# EAGLE schematic design (EAGLE 7.3.0)

## Sheet 1 of 5: MCU
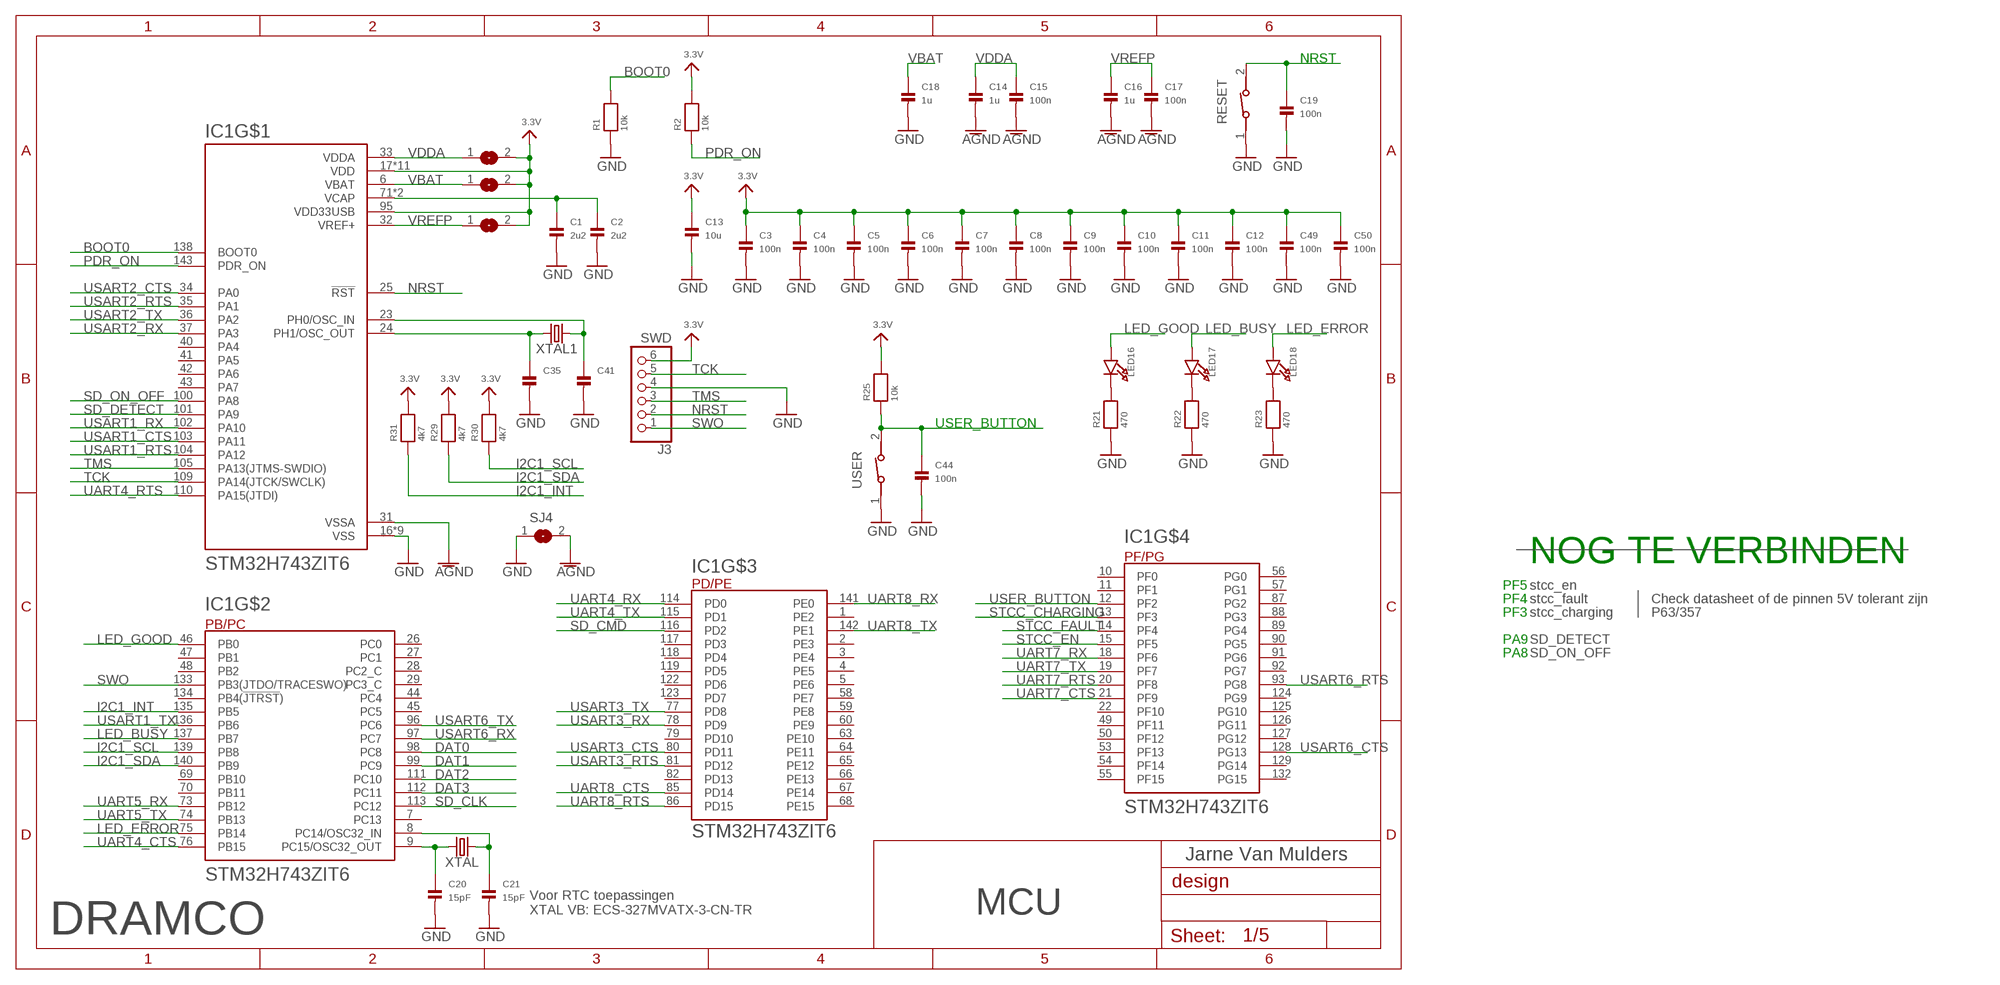
[diagram p0: schematic, sheet 1]

### Parts
C1  2u2  CAP_CERAMIC0805  [0805]
C2  2u2  CAP_CERAMIC0805  [0805]
C3  100n  CAP_CERAMIC0603  [0603]
C4  100n  CAP_CERAMIC0603  [0603]
C5  100n  CAP_CERAMIC0603  [0603]
C6  100n  CAP_CERAMIC0603  [0603]
C7  100n  CAP_CERAMIC0603  [0603]
C8  100n  CAP_CERAMIC0603  [0603]
C9  100n  CAP_CERAMIC0603  [0603]
C10  100n  CAP_CERAMIC0603  [0603]
C11  100n  CAP_CERAMIC0603  [0603]
C12  100n  CAP_CERAMIC0603  [0603]
C13  10u  CAP_CERAMIC0805  [0805]
C14  1u  CAP_CERAMIC0603  [0603]
C15  100n  CAP_CERAMIC0603  [0603]
C16  1u  CAP_CERAMIC0603  [0603]
C17  100n  CAP_CERAMIC0603  [0603]
C18  1u  CAP_CERAMIC0603  [0603]
C19  100n  CAP_CERAMIC0603  [0603]
C20  15pF  CAP_CERAMIC0603  [0603]
C21  15pF  CAP_CERAMIC0603  [0603]
C35  CAP_CERAMIC0603  [0603]
C41  CAP_CERAMIC0603  [0603]
C44  100n  CAP_CERAMIC0603  [0603]
C49  100n  CAP_CERAMIC0603  [0603]
C50  100n  CAP_CERAMIC0603  [0603]
IC1  STM32H743ZIT6  [QFP50P2200X2200X160-144N]
J3  SWD  HEADER-1X6ROUND  [1X06_ROUND]
LED16  LED0805  [CHIPLED_0805]
LED17  LED0805  [CHIPLED_0805]
LED18  LED0805  [CHIPLED_0805]
R1  10k  RESISTOR0603  [0603]
R2  10k  RESISTOR0603  [0603]
R21  470  RESISTOR0603  [0603]
R22  470  RESISTOR0603  [0603]
R23  470  RESISTOR0603  [0603]
R25  10k  RESISTOR0603  [0603]
R29  4k7  RESISTOR0603  [0603]
R30  4k7  RESISTOR0603  [0603]
R31  4k7  RESISTOR0603  [0603]
RESET  434111043826  [434111043826]
SJ1  SOLDERJUMPERCLOSED  [SOLDERJUMPER_CLOSEDWIRE]
SJ2  SOLDERJUMPERCLOSED  [SOLDERJUMPER_CLOSEDWIRE]
SJ3  SOLDERJUMPERCLOSED  [SOLDERJUMPER_CLOSEDWIRE]
SJ4  SOLDERJUMPERCLOSED  [SOLDERJUMPER_CLOSEDWIRE]
USER  434111043826  [434111043826]
XTAL  CRYSTALSMD-3.2X2.5  [CRYSTAL-SMD-3.2X2.5MM]
XTAL1  CRYSTALSMD-3.2X2.5  [CRYSTAL-SMD-3.2X2.5MM]

### Nets
3.3V: C3.1 C4.1 C5.1 C6.1 C7.1 C8.1 C9.1 C10.1 C11.1 C12.1 C13.1 C49.1 C50.1 IC1.17(VDD) IC1.30(VDD) IC1.39(VDD) IC1.52(VDD) IC1.62(VDD) IC1.72(VDD) IC1.84(VDD) IC1.95(VDD33USB) IC1.108(VDD) IC1.121(VDD) IC1.131(VDD) IC1.144(VDD) J3.6 R2.2 R25.2 R29.2 R30.2 R31.2 SJ1.2 SJ2.2 SJ3.2 ; also sheet 2,3,4,5
AGND: C14.2 C15.2 C16.2 C17.2 IC1.31(VSSA) SJ4.2
BOOT0: IC1.138(BOOT0) R1.2
DAT0: IC1.98(PC8) ; also sheet 5
DAT1: IC1.99(PC9) ; also sheet 5
DAT2: IC1.111(PC10) ; also sheet 5
DAT3: IC1.112(PC11) ; also sheet 5
GND: C1.2 C2.2 C3.2 C4.2 C5.2 C6.2 C7.2 C8.2 C9.2 C10.2 C11.2 C12.2 C13.2 C18.2 C19.2 C20.2 C21.2 C35.2 C41.2 C44.2 C49.2 C50.2 IC1.16(VSS) IC1.38(VSS) IC1.51(VSS) IC1.61(VSS) IC1.83(VSS) IC1.94(VSS) IC1.107(VSS) IC1.120(VSS) IC1.130(VSS) J3.4 R1.1 R21.1 R22.1 R23.1 RESET.1 SJ4.1 USER.1 ; also sheet 2,3,4,5
I2C1_INT: IC1.135(PB5) R31.1 ; also sheet 5
I2C1_SCL: IC1.139(PB8) R30.1 ; also sheet 5
I2C1_SDA: IC1.140(PB9) R29.1 ; also sheet 5
LED_BUSY: IC1.137(PB7) LED17.A
LED_ERROR: IC1.75(PB14) LED18.A
LED_GOOD: IC1.46(PB0) LED16.A
N$2: C1.1 C2.1 IC1.71(VCAP) IC1.106(VCAP)
N$3: C20.1 IC1.9(PC15/OSC32_OUT) XTAL.3
N$4: C21.1 IC1.8(PC14/OSC32_IN) XTAL.1
N$18: LED16.C R21.2
N$19: LED17.C R22.2
N$22: C35.1 IC1.24(PH1/OSC_OUT) XTAL1.3
N$38: LED18.C R23.2
N$47: C41.1 IC1.23(PH0/OSC_IN) XTAL1.1
NRST: C19.1 IC1.25(!RST) J3.2 RESET.2
PDR_ON: IC1.143(PDR_ON) R2.1
SD_CLK: IC1.113(PC12) ; also sheet 5
SD_CMD: IC1.116(PD2) ; also sheet 5
SD_DETECT: IC1.101(PA9) ; also sheet 5
SD_ON_OFF: IC1.100(PA8) ; also sheet 5
STCC_CHARGING: IC1.13(PF3) ; also sheet 4
STCC_EN: IC1.15(PF5) ; also sheet 4
STCC_FAULT: IC1.14(PF4) ; also sheet 4
SWO: IC1.133(PB3(JTDO/TRACESWO)) J3.1
TCK: IC1.109(PA14(JTCK/SWCLK)) J3.5
TMS: IC1.105(PA13(JTMS-SWDIO)) J3.3
UART4_CTS: IC1.76(PB15) ; also sheet 3
UART4_RTS: IC1.110(PA15(JTDI)) ; also sheet 3
UART4_RX: IC1.114(PD0) ; also sheet 3
UART4_TX: IC1.115(PD1) ; also sheet 3
UART5_RX: IC1.73(PB12) ; also sheet 2
UART5_TX: IC1.74(PB13) ; also sheet 2
UART7_CTS: IC1.21(PF9) ; also sheet 3
UART7_RTS: IC1.20(PF8) ; also sheet 3
UART7_RX: IC1.18(PF6) ; also sheet 3
UART7_TX: IC1.19(PF7) ; also sheet 3
UART8_CTS: IC1.85(PD14) ; also sheet 3
UART8_RTS: IC1.86(PD15) ; also sheet 3
UART8_RX: IC1.141(PE0) ; also sheet 3
UART8_TX: IC1.142(PE1) ; also sheet 3
USART1_CTS: IC1.103(PA11) ; also sheet 3
USART1_RTS: IC1.104(PA12) ; also sheet 3
USART1_RX: IC1.102(PA10) ; also sheet 3
USART1_TX: IC1.136(PB6) ; also sheet 3
USART2_CTS: IC1.34(PA0) ; also sheet 3
USART2_RTS: IC1.35(PA1) ; also sheet 3
USART2_RX: IC1.37(PA3) ; also sheet 3
USART2_TX: IC1.36(PA2) ; also sheet 3
USART3_CTS: IC1.80(PD11) ; also sheet 2
USART3_RTS: IC1.81(PD12) ; also sheet 2
USART3_RX: IC1.78(PD9) ; also sheet 2
USART3_TX: IC1.77(PD8) ; also sheet 2
USART6_CTS: IC1.128(PG13) ; also sheet 3
USART6_RTS: IC1.93(PG8) ; also sheet 3
USART6_RX: IC1.97(PC7) ; also sheet 3
USART6_TX: IC1.96(PC6) ; also sheet 3
USER_BUTTON: C44.1 IC1.12(PF2) R25.1 USER.2
VBAT: C18.1 IC1.6(VBAT) SJ2.1
VDDA: C14.1 C15.1 IC1.33(VDDA) SJ3.1
VREFP: C16.1 C17.1 IC1.32(VREF+) SJ1.1
Unconnected: IC1.1(PE2) IC1.2(PE3) IC1.3(PE4) IC1.4(PE5) IC1.5(PE6) IC1.7(PC13) IC1.10(PF0) IC1.11(PF1) IC1.22(PF10) IC1.26(PC0) IC1.27(PC1) IC1.28(PC2_C) IC1.29(PC3_C) IC1.40(PA4) IC1.41(PA5) IC1.42(PA6) IC1.43(PA7) IC1.44(PC4) IC1.45(PC5) IC1.47(PB1) IC1.48(PB2) IC1.49(PF11) IC1.50(PF12) IC1.53(PF13) IC1.54(PF14) IC1.55(PF15) IC1.56(PG0) IC1.57(PG1) IC1.58(PE7) IC1.59(PE8) IC1.60(PE9) IC1.63(PE10) IC1.64(PE11) IC1.65(PE12) IC1.66(PE13) IC1.67(PE14) IC1.68(PE15) IC1.69(PB10) IC1.70(PB11) IC1.79(PD10) IC1.82(PD13) IC1.87(PG2) IC1.88(PG3) IC1.89(PG4) IC1.90(PG5) IC1.91(PG6) IC1.92(PG7) IC1.117(PD3) IC1.118(PD4) IC1.119(PD5) IC1.122(PD6) IC1.123(PD7) IC1.124(PG9) IC1.125(PG10) IC1.126(PG11) IC1.127(PG12) IC1.129(PG14) IC1.132(PG15) IC1.134(PB4(!JTRST!))

### Notes on the sheet
- NOG TE VERBINDEN
- PF5 | stcc_en
- PF4 | stcc_fault | Check datasheet of de pinnen 5V tolerant zijn
- PF3 | stcc_charging | P63/357
- PA9 | SD_DETECT
- PA8 | SD_ON_OFF
- Jarne Van Mulders
- Voor RTC toepassingen
  XTAL VB: ECS-327MVATX-3-CN-TR
- MCU
- DRAMCO

## Sheet 2 of 5: USB
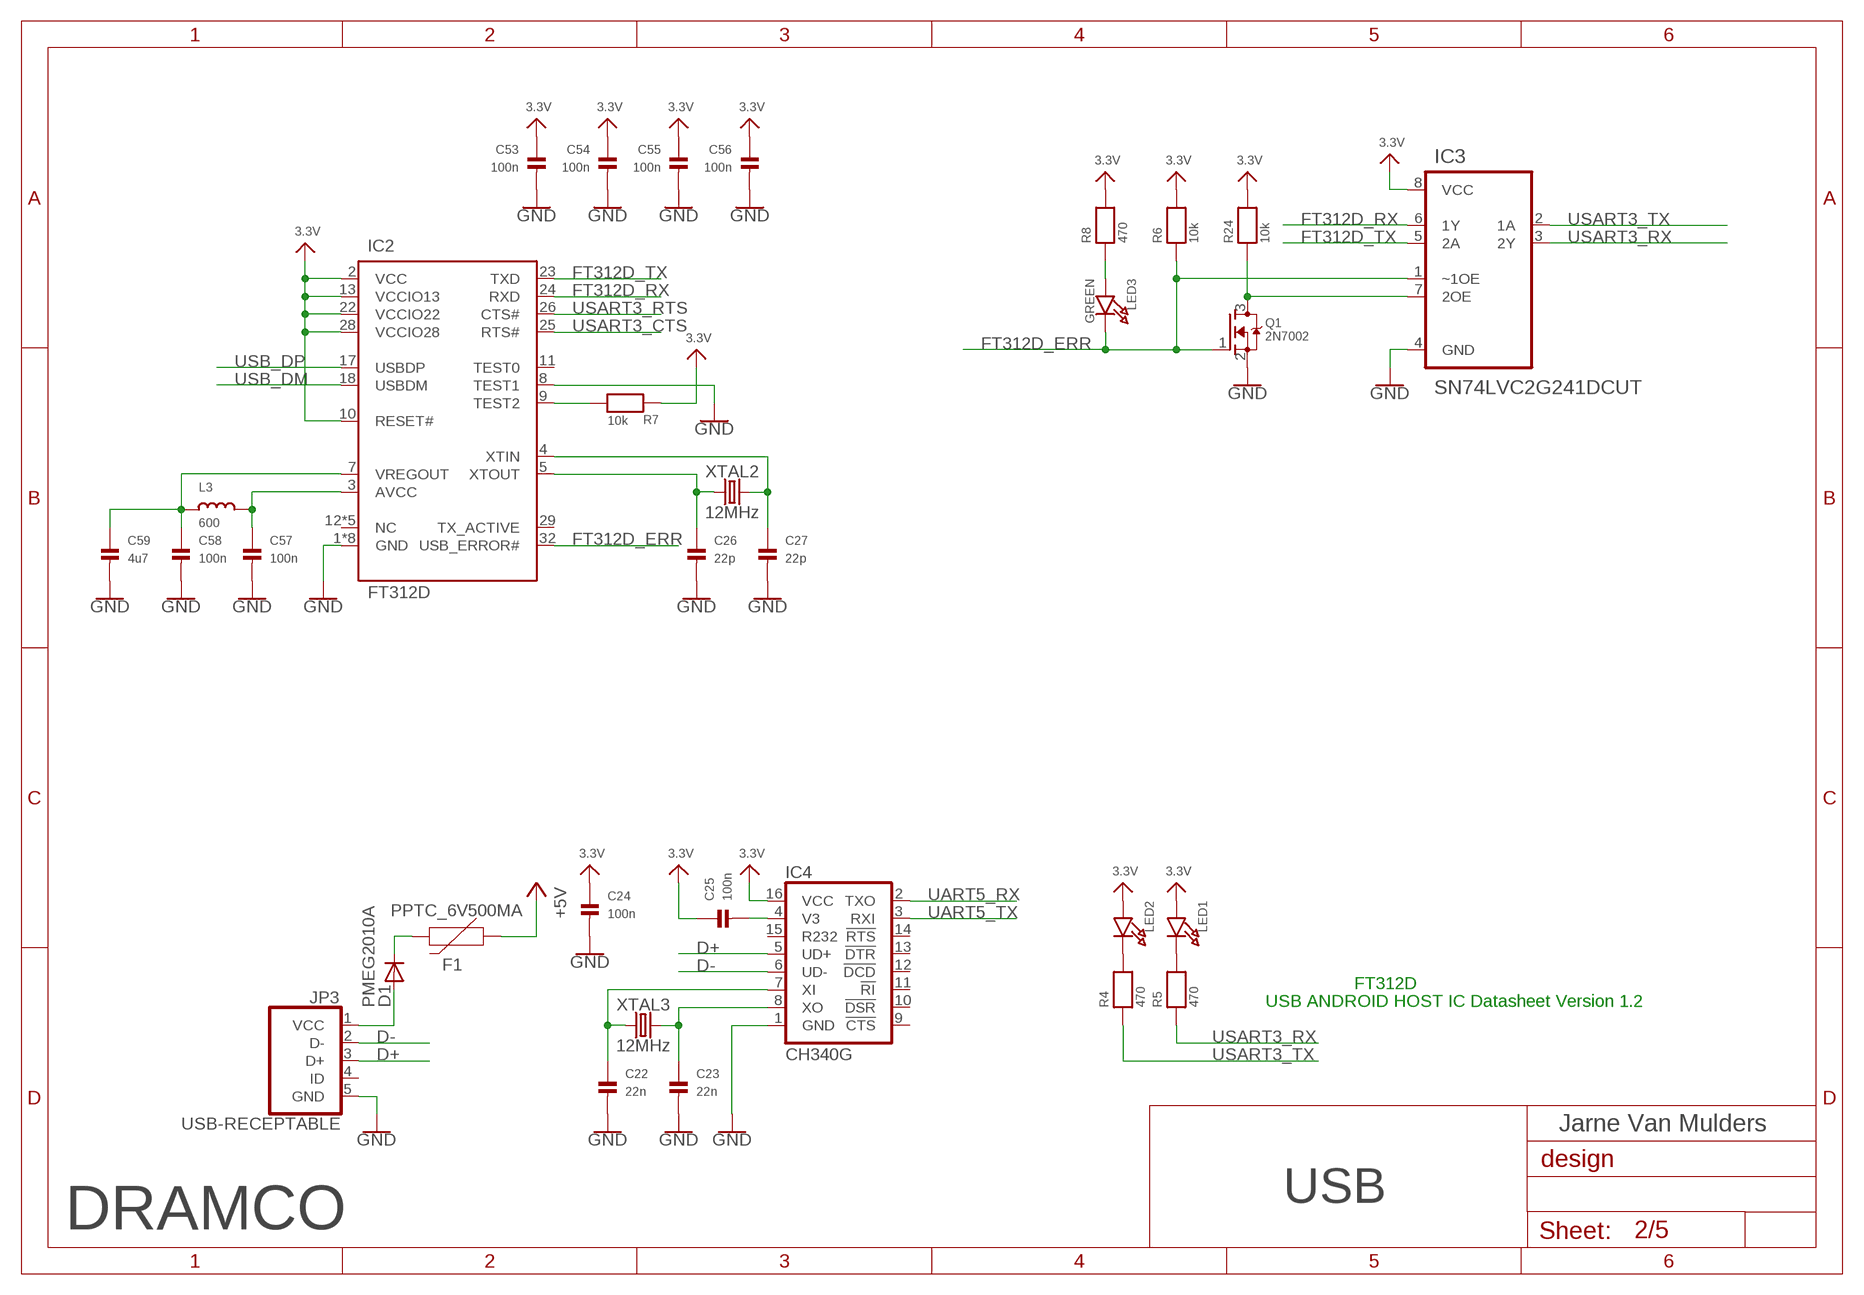
[diagram p1: schematic, sheet 2]

### Parts
C22  22n  CAP_CERAMIC0603  [0603]
C23  22n  CAP_CERAMIC0603  [0603]
C24  100n  CAP_CERAMIC0603  [0603]
C25  100n  CAP_CERAMIC0603  [0603]
C26  22p  CAP_CERAMIC0603  [0603]
C27  22p  CAP_CERAMIC0603  [0603]
C53  100n  CAP_CERAMIC0603  [0603]
C54  100n  CAP_CERAMIC0603  [0603]
C55  100n  CAP_CERAMIC0603  [0603]
C56  100n  CAP_CERAMIC0603  [0603]
C57  100n  CAP_CERAMIC0603  [0603]
C58  100n  CAP_CERAMIC0603  [0603]
C59  4u7  CAP_CERAMIC0603  [0603]
D1  PMEG2010A  DIODE-SOD323-W  [SOD323-W]
F1  PPTC_6V500MA  [0805]
IC2  FT312D  [QFP80P900X900X160-32N]
IC3  SN74LVC2G241DCUT  [SOP50P310X90-8N]
IC4  CH340G  CH340GSMD  [SO016]
JP3  USB-RECEPTABLE  [FCI-10103594-0001LF]
L3  600  INDUCTOR0603  [0603]
LED1  LED0805  [CHIPLED_0805]
LED2  LED0805  [CHIPLED_0805]
LED3  GREEN  LED0805  [CHIPLED_0805]
Q1  2N7002  MOSFET-NWIDE  [SOT23-WIDE]
R4  470  RESISTOR0603  [0603]
R5  470  RESISTOR0603  [0603]
R6  10k  RESISTOR0603  [0603]
R7  10k  RESISTOR0603  [0603]
R8  470  RESISTOR0603  [0603]
R24  10k  RESISTOR0603  [0603]
XTAL2  12MHz  CRYSTALSMD-3.2X2.5  [CRYSTAL-SMD-3.2X2.5MM]
XTAL3  12MHz  CRYSTALSMD-3.2X2.5  [CRYSTAL-SMD-3.2X2.5MM]

### Nets
3.3V: C24.1 C25.1 C53.1 C54.1 C55.1 C56.1 IC2.2(VCC) IC2.10(RESET#) IC2.13(VCCIO13) IC2.22(VCCIO22) IC2.28(VCCIO28) IC3.8(VCC) IC4.16(VCC) LED1.A LED2.A R6.2 R7.2 R8.2 R24.2 ; also sheet 1,3,4,5
+5V: F1.1 ; also sheet 4
D+: IC4.5(UD+) JP3.3(D+)
D-: IC4.6(UD-) JP3.2(D-)
FT312D_ERR: IC2.32(USB_ERROR#) IC3.1(~1OE) LED3.C Q1.1(G) R6.1
FT312D_RX: IC2.24(RXD) IC3.6(1Y)
FT312D_TX: IC2.23(TXD) IC3.5(2A)
GND: C22.2 C23.2 C24.2 C26.2 C27.2 C53.2 C54.2 C55.2 C56.2 C57.2 C58.2 C59.2 IC2.1(GND) IC2.6(GND) IC2.8(TEST1) IC2.14(GND) IC2.15(GND) IC2.16(GND) IC2.19(GND) IC2.27(GND) IC2.33(GND) IC3.4(GND) IC4.1(GND) JP3.5(GND) Q1.2(S) ; also sheet 1,3,4,5
N$1: LED2.C R4.2
N$5: LED1.C R5.2
N$6: C27.1 IC2.4(XTIN) XTAL2.3
N$7: C26.1 IC2.5(XTOUT) XTAL2.1
N$10: D1.C F1.2
N$13: LED3.A R8.1
N$14: IC2.9(TEST2) R7.1
N$15: IC3.7(2OE) Q1.3(D) R24.1
N$16: D1.A JP3.1(VCC)
N$29: C22.1 IC4.7(XI) XTAL3.1
N$32: C23.1 IC4.8(XO) XTAL3.3
N$34: C25.2 IC4.4(V3)
N$41: C58.1 C59.1 IC2.7(VREGOUT) L3.1
N$42: C57.1 IC2.3(AVCC) L3.2
UART5_RX: IC4.2(TXO) ; also sheet 1
UART5_TX: IC4.3(RXI) ; also sheet 1
USART3_CTS: IC2.25(RTS#) ; also sheet 1
USART3_RTS: IC2.26(CTS#) ; also sheet 1
USART3_RX: IC3.3(2Y) R5.1 ; also sheet 1
USART3_TX: IC3.2(1A) R4.1 ; also sheet 1
USB_DM: IC2.18(USBDM) ; also sheet 4
USB_DP: IC2.17(USBDP) ; also sheet 4
Unconnected: IC2.11(TEST0) IC2.12(NC) IC2.20(NC) IC2.21(NC) IC2.29(TX_ACTIVE) IC2.30(NC) IC2.31(NC) IC4.9(!CTS) IC4.10(!DSR) IC4.11(!RI) IC4.12(!DCD) IC4.13(!DTR) IC4.14(!RTS) IC4.15(R232) JP3.4(ID)

### Notes on the sheet
- FT312D
- USB ANDROID HOST IC Datasheet Version 1.2
- Jarne Van Mulders
- USB
- DRAMCO

## Sheet 3 of 5: Bluetooth
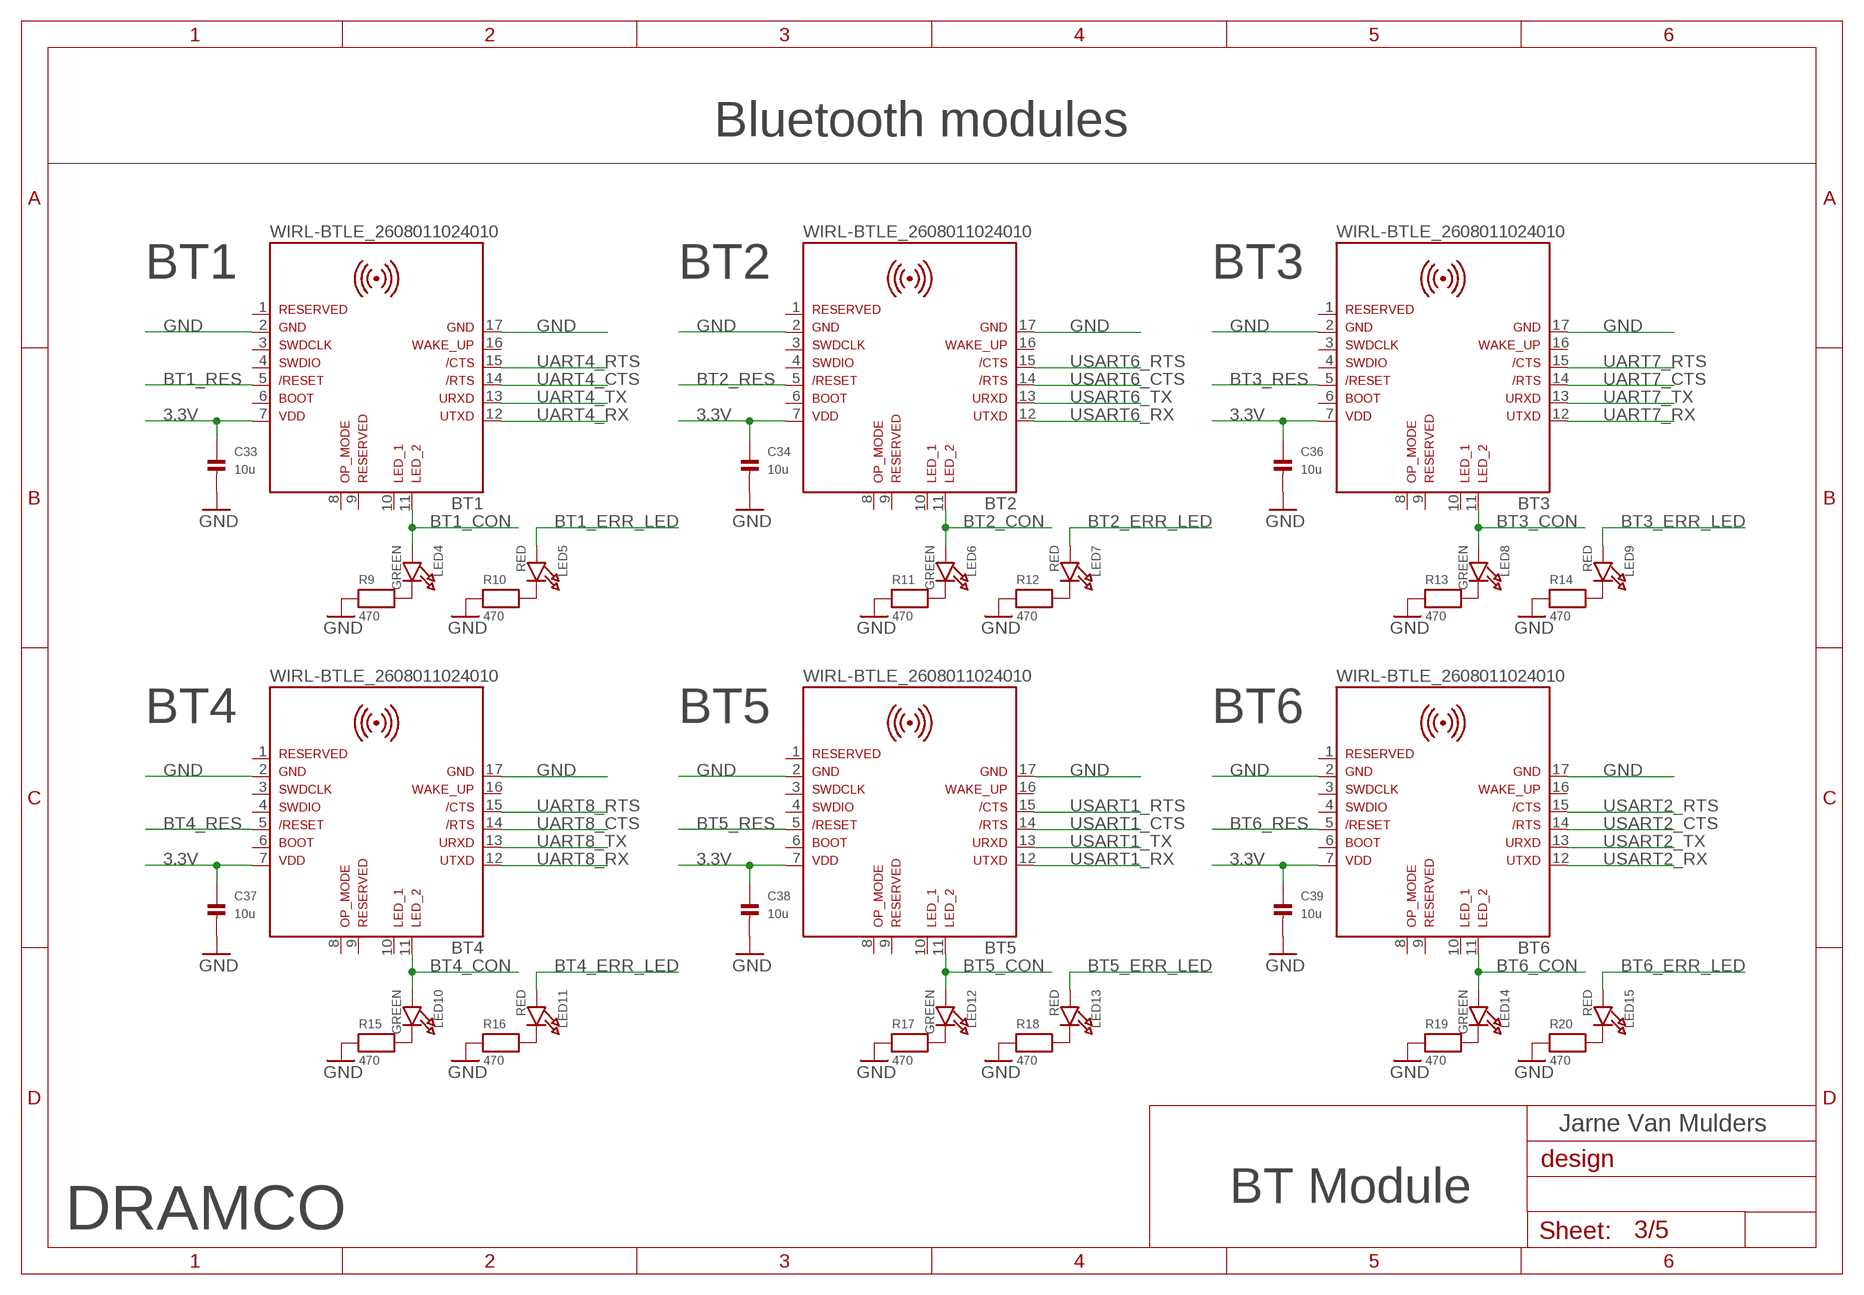
[diagram p2: schematic, sheet 3]

### Parts
BT1  WIRL-BTLE_2608011024010  [WIRL-BTLE_2608011024010]
BT2  WIRL-BTLE_2608011024010  [WIRL-BTLE_2608011024010]
BT3  WIRL-BTLE_2608011024010  [WIRL-BTLE_2608011024010]
BT4  WIRL-BTLE_2608011024010  [WIRL-BTLE_2608011024010]
BT5  WIRL-BTLE_2608011024010  [WIRL-BTLE_2608011024010]
BT6  WIRL-BTLE_2608011024010  [WIRL-BTLE_2608011024010]
C33  10u  CAP_CERAMIC0805  [0805]
C34  10u  CAP_CERAMIC0805  [0805]
C36  10u  CAP_CERAMIC0805  [0805]
C37  10u  CAP_CERAMIC0805  [0805]
C38  10u  CAP_CERAMIC0805  [0805]
C39  10u  CAP_CERAMIC0805  [0805]
LED4  GREEN  LED0805  [CHIPLED_0805]
LED5  RED  LED0805  [CHIPLED_0805]
LED6  GREEN  LED0805  [CHIPLED_0805]
LED7  RED  LED0805  [CHIPLED_0805]
LED8  GREEN  LED0805  [CHIPLED_0805]
LED9  RED  LED0805  [CHIPLED_0805]
LED10  GREEN  LED0805  [CHIPLED_0805]
LED11  RED  LED0805  [CHIPLED_0805]
LED12  GREEN  LED0805  [CHIPLED_0805]
LED13  RED  LED0805  [CHIPLED_0805]
LED14  GREEN  LED0805  [CHIPLED_0805]
LED15  RED  LED0805  [CHIPLED_0805]
R9  470  RESISTOR0603  [0603]
R10  470  RESISTOR0603  [0603]
R11  470  RESISTOR0603  [0603]
R12  470  RESISTOR0603  [0603]
R13  470  RESISTOR0603  [0603]
R14  470  RESISTOR0603  [0603]
R15  470  RESISTOR0603  [0603]
R16  470  RESISTOR0603  [0603]
R17  470  RESISTOR0603  [0603]
R18  470  RESISTOR0603  [0603]
R19  470  RESISTOR0603  [0603]
R20  470  RESISTOR0603  [0603]

### Nets
3.3V: BT1.7 BT2.7 BT3.7 BT4.7 BT5.7 BT6.7 C33.1 C34.1 C36.1 C37.1 C38.1 C39.1 ; also sheet 1,2,4,5
BT1_CON: BT1.11 LED4.A ; also sheet 5
BT1_ERR_LED: LED5.A ; also sheet 5
BT1_RES: BT1.5 ; also sheet 5
BT2_CON: BT2.11 LED6.A ; also sheet 5
BT2_ERR_LED: LED7.A ; also sheet 5
BT2_RES: BT2.5 ; also sheet 5
BT3_CON: BT3.11 LED8.A ; also sheet 5
BT3_ERR_LED: LED9.A ; also sheet 5
BT3_RES: BT3.5 ; also sheet 5
BT4_CON: BT4.11 LED10.A ; also sheet 5
BT4_ERR_LED: LED11.A ; also sheet 5
BT4_RES: BT4.5 ; also sheet 5
BT5_CON: BT5.11 LED12.A ; also sheet 5
BT5_ERR_LED: LED13.A ; also sheet 5
BT5_RES: BT5.5 ; also sheet 5
BT6_CON: BT6.11 LED14.A ; also sheet 5
BT6_ERR_LED: LED15.A ; also sheet 5
BT6_RES: BT6.5 ; also sheet 5
GND: BT1.2 BT1.17 BT2.2 BT2.17 BT3.2 BT3.17 BT4.2 BT4.17 BT5.2 BT5.17 BT6.2 BT6.17 C33.2 C34.2 C36.2 C37.2 C38.2 C39.2 R9.1 R10.1 R11.1 R12.1 R13.1 R14.1 R15.1 R16.1 R17.1 R18.1 R19.1 R20.1 ; also sheet 1,2,4,5
N$21: LED4.C R9.2
N$23: LED5.C R10.2
N$25: LED6.C R11.2
N$26: LED7.C R12.2
N$27: LED8.C R13.2
N$28: LED9.C R14.2
N$30: LED10.C R15.2
N$31: LED11.C R16.2
N$33: LED12.C R17.2
N$35: LED13.C R18.2
N$36: LED14.C R19.2
N$37: LED15.C R20.2
UART4_CTS: BT1.14 ; also sheet 1
UART4_RTS: BT1.15 ; also sheet 1
UART4_RX: BT1.12 ; also sheet 1
UART4_TX: BT1.13 ; also sheet 1
UART7_CTS: BT3.14 ; also sheet 1
UART7_RTS: BT3.15 ; also sheet 1
UART7_RX: BT3.12 ; also sheet 1
UART7_TX: BT3.13 ; also sheet 1
UART8_CTS: BT4.14 ; also sheet 1
UART8_RTS: BT4.15 ; also sheet 1
UART8_RX: BT4.12 ; also sheet 1
UART8_TX: BT4.13 ; also sheet 1
USART1_CTS: BT5.14 ; also sheet 1
USART1_RTS: BT5.15 ; also sheet 1
USART1_RX: BT5.12 ; also sheet 1
USART1_TX: BT5.13 ; also sheet 1
USART2_CTS: BT6.14 ; also sheet 1
USART2_RTS: BT6.15 ; also sheet 1
USART2_RX: BT6.12 ; also sheet 1
USART2_TX: BT6.13 ; also sheet 1
USART6_CTS: BT2.14 ; also sheet 1
USART6_RTS: BT2.15 ; also sheet 1
USART6_RX: BT2.12 ; also sheet 1
USART6_TX: BT2.13 ; also sheet 1
Unconnected: BT1.1 BT1.3 BT1.4 BT1.6 BT1.8 BT1.9 BT1.10 BT1.16 BT2.1 BT2.3 BT2.4 BT2.6 BT2.8 BT2.9 BT2.10 BT2.16 BT3.1 BT3.3 BT3.4 BT3.6 BT3.8 BT3.9 BT3.10 BT3.16 BT4.1 BT4.3 BT4.4 BT4.6 BT4.8 BT4.9 BT4.10 BT4.16 BT5.1 BT5.3 BT5.4 BT5.6 BT5.8 BT5.9 BT5.10 BT5.16 BT6.1 BT6.3 BT6.4 BT6.6 BT6.8 BT6.9 BT6.10 BT6.16

### Notes on the sheet
- Bluetooth modules
- BT1 | BT2 | BT3
- BT4 | BT5 | BT6
- Jarne Van Mulders
- BT Module
- DRAMCO

## Sheet 4 of 5: Power
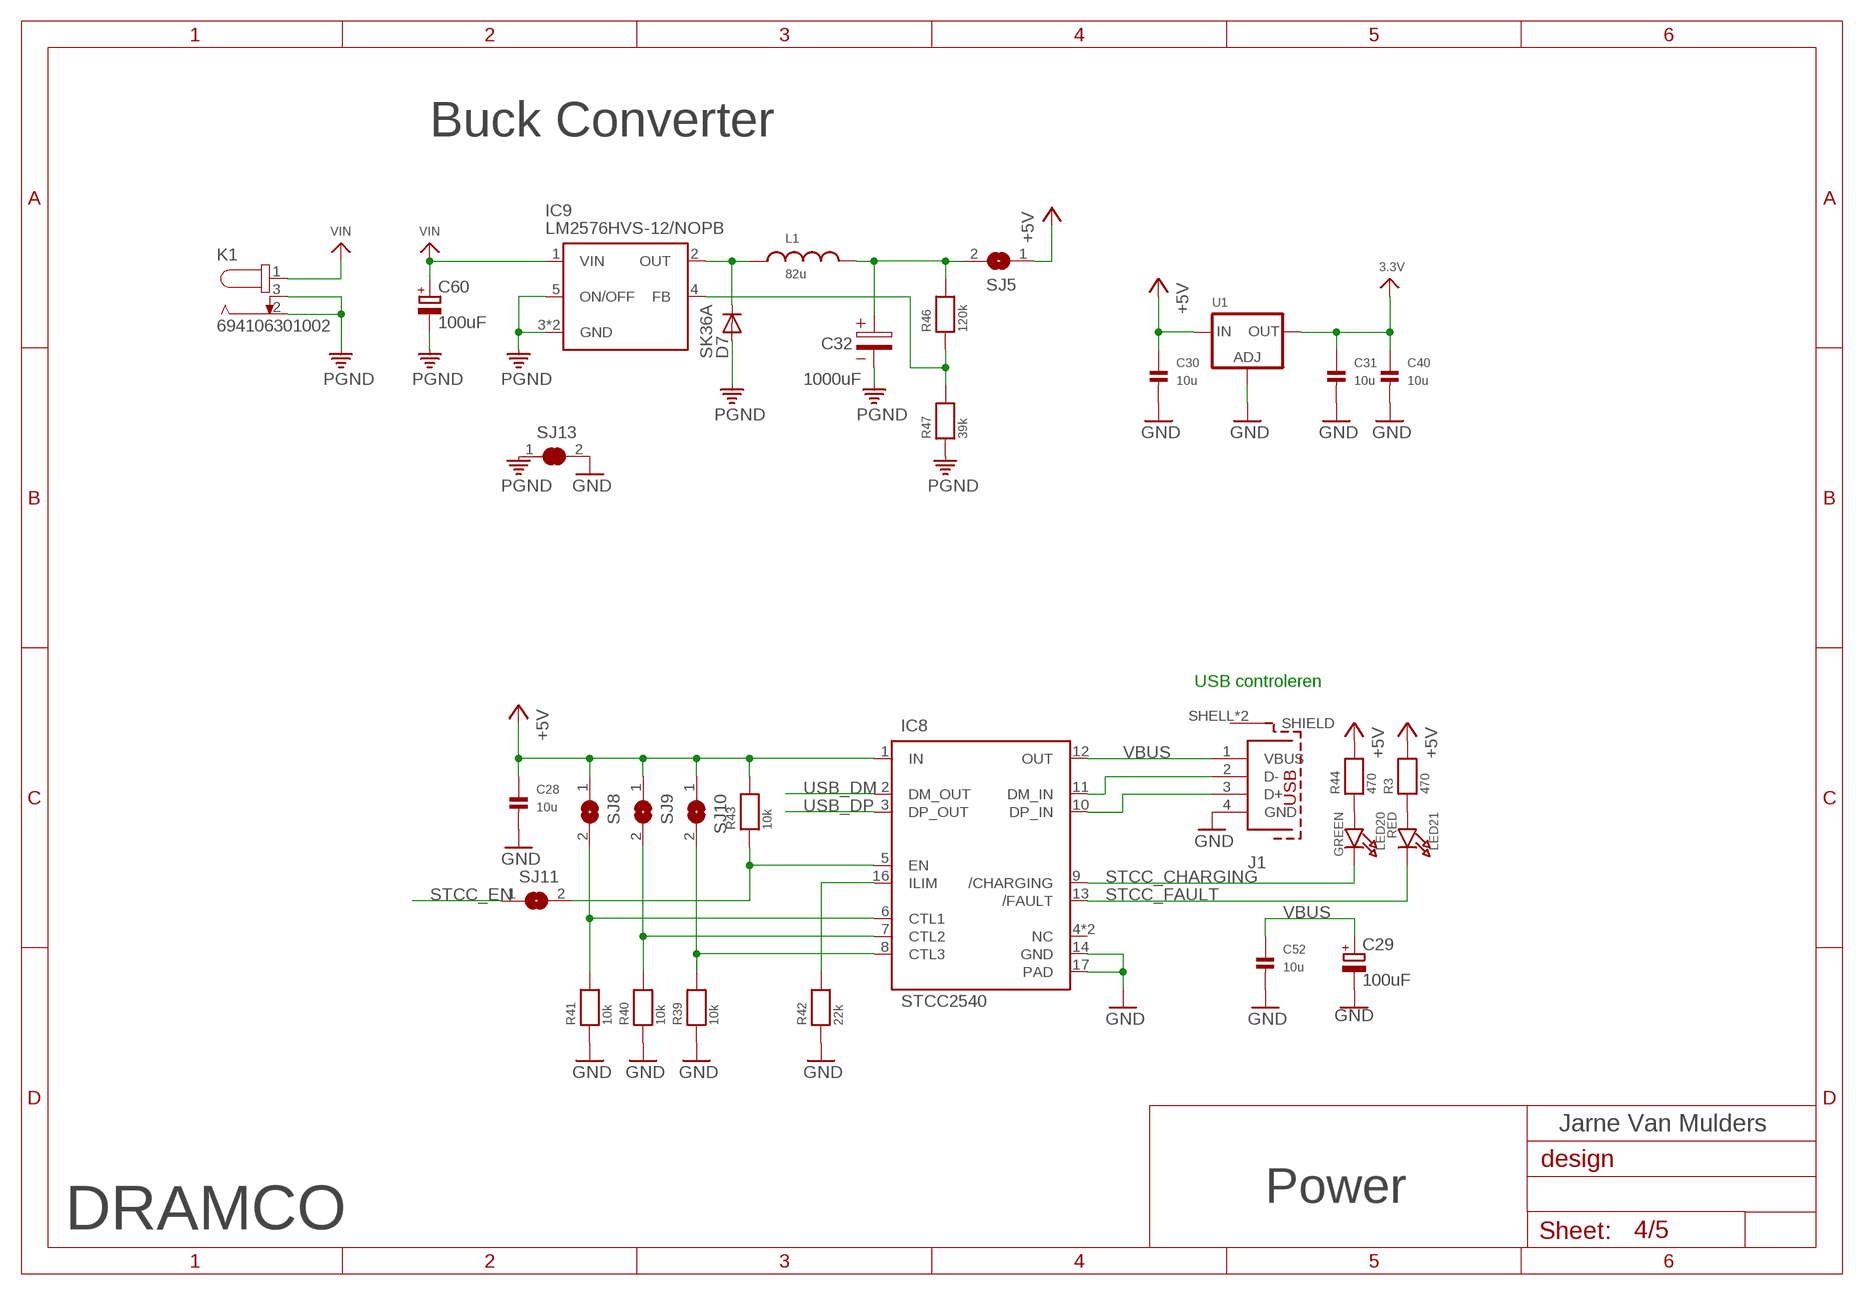
[diagram p3: schematic, sheet 4]

### Parts
C28  10u  CAP_CERAMIC0805  [0805]
C29  100uF  CPOL-EUE2.5-6  [E2,5-6]
C30  10u  CAP_CERAMIC0805  [0805]
C31  10u  CAP_CERAMIC0805  [0805]
C32  1000uF  WCAP-ATG8_10X12,5_860010275016  [10X5X0.9(DXAXB)]
C40  10u  CAP_CERAMIC0805  [0805]
C52  10u  CAP_CERAMIC0805  [0805]
C60  100uF  CPOL-EUE2.5-6  [E2,5-6]
D7  SK36A  DIODE-DO214AA  [DO214AA]
IC8  STCC2540  [QFN50P300X300X80-17N]
IC9  LM2576HVS-12/NOPB  [TO263-5]
J1  614004190021  [614004190021]
K1  694106301002  [694106301002]
L1  82u  WE-PD_1210_7447709820  [WE-PD_1260/1245/1280/1210]
LED20  GREEN  LED0805  [CHIPLED_0805]
LED21  RED  LED0805  [CHIPLED_0805]
R3  470  RESISTOR0603  [0603]
R39  10k  RESISTOR0603  [0603]
R40  10k  RESISTOR0603  [0603]
R41  10k  RESISTOR0603  [0603]
R42  22k  RESISTOR0603  [0603]
R43  10k  RESISTOR0603  [0603]
R44  470  RESISTOR0603  [0603]
R46  120k  RESISTOR0805  [0805]
R47  39k  RESISTOR0805  [0805]
SJ5  SOLDERJUMPERREFLOW  [SOLDERJUMPER_REFLOW]
SJ8  SOLDERJUMPERREFLOW  [SOLDERJUMPER_REFLOW]
SJ9  SOLDERJUMPERREFLOW  [SOLDERJUMPER_REFLOW]
SJ10  SOLDERJUMPERREFLOW  [SOLDERJUMPER_REFLOW]
SJ11  SOLDERJUMPERREFLOW  [SOLDERJUMPER_REFLOW]
SJ13  SOLDERJUMPER_CLOSED  [SOLDERJUMPER_CLOSEDWIRE]
U1  LM1117SOT223-REFLOW  [SOT223-R]

### Nets
3.3V: C31.1 C40.1 U1.2(OUT) ; also sheet 1,2,3,5
+5V: C28.1 C30.1 IC8.1(IN) R3.2 R43.2 R44.2 SJ5.1 SJ8.1 SJ9.1 SJ10.1 U1.3(IN) ; also sheet 2
B_OUT: D7.C IC9.2(OUT) L1.1
BUCK_OUT: C32.1 L1.2 R46.2 SJ5.2
FB: IC9.4(FB) R46.1 R47.2
GND: C28.2 C29.- C30.2 C31.2 C40.2 C52.2 IC8.14(GND) IC8.17(PAD) J1.4(GND) R39.1 R40.1 R41.1 R42.1 SJ13.2 U1.1(ADJ) ; also sheet 1,2,3,5
N$8: LED20.A R44.1
N$9: LED21.A R3.1
N$24: IC8.16(ILIM) R42.2
N$39: IC8.11(DM_IN) J1.2(D-)
N$40: IC8.10(DP_IN) J1.3(D+)
N$43: IC8.8(CTL3) R39.2 SJ10.2
N$44: IC8.7(CTL2) R40.2 SJ9.2
N$45: IC8.6(CTL1) R41.2 SJ8.2
N$46: IC8.5(EN) R43.1 SJ11.2
PGND: C32.2 C60.- D7.A IC9.3(GND) IC9.5(ON/OFF) IC9.6(GND) K1.2 K1.3 R47.1 SJ13.1
STCC_CHARGING: IC8.9(/CHARGING) LED20.C ; also sheet 1
STCC_EN: SJ11.1 ; also sheet 1
STCC_FAULT: IC8.13(/FAULT) LED21.C ; also sheet 1
USB_DM: IC8.2(DM_OUT) ; also sheet 2
USB_DP: IC8.3(DP_OUT) ; also sheet 2
VBUS: C29.+ C52.1 IC8.12(OUT) J1.1(VBUS)
VIN: C60.+ IC9.1(VIN) K1.1
Unconnected: IC8.4(NC) IC8.15(NC) J1.SHELL1(SHIELD) J1.SHELL(SHIELD)

### Notes on the sheet
- Buck Converter
- USB controleren
- Jarne Van Mulders
- Power
- DRAMCO

## Sheet 5 of 5: IO Exp
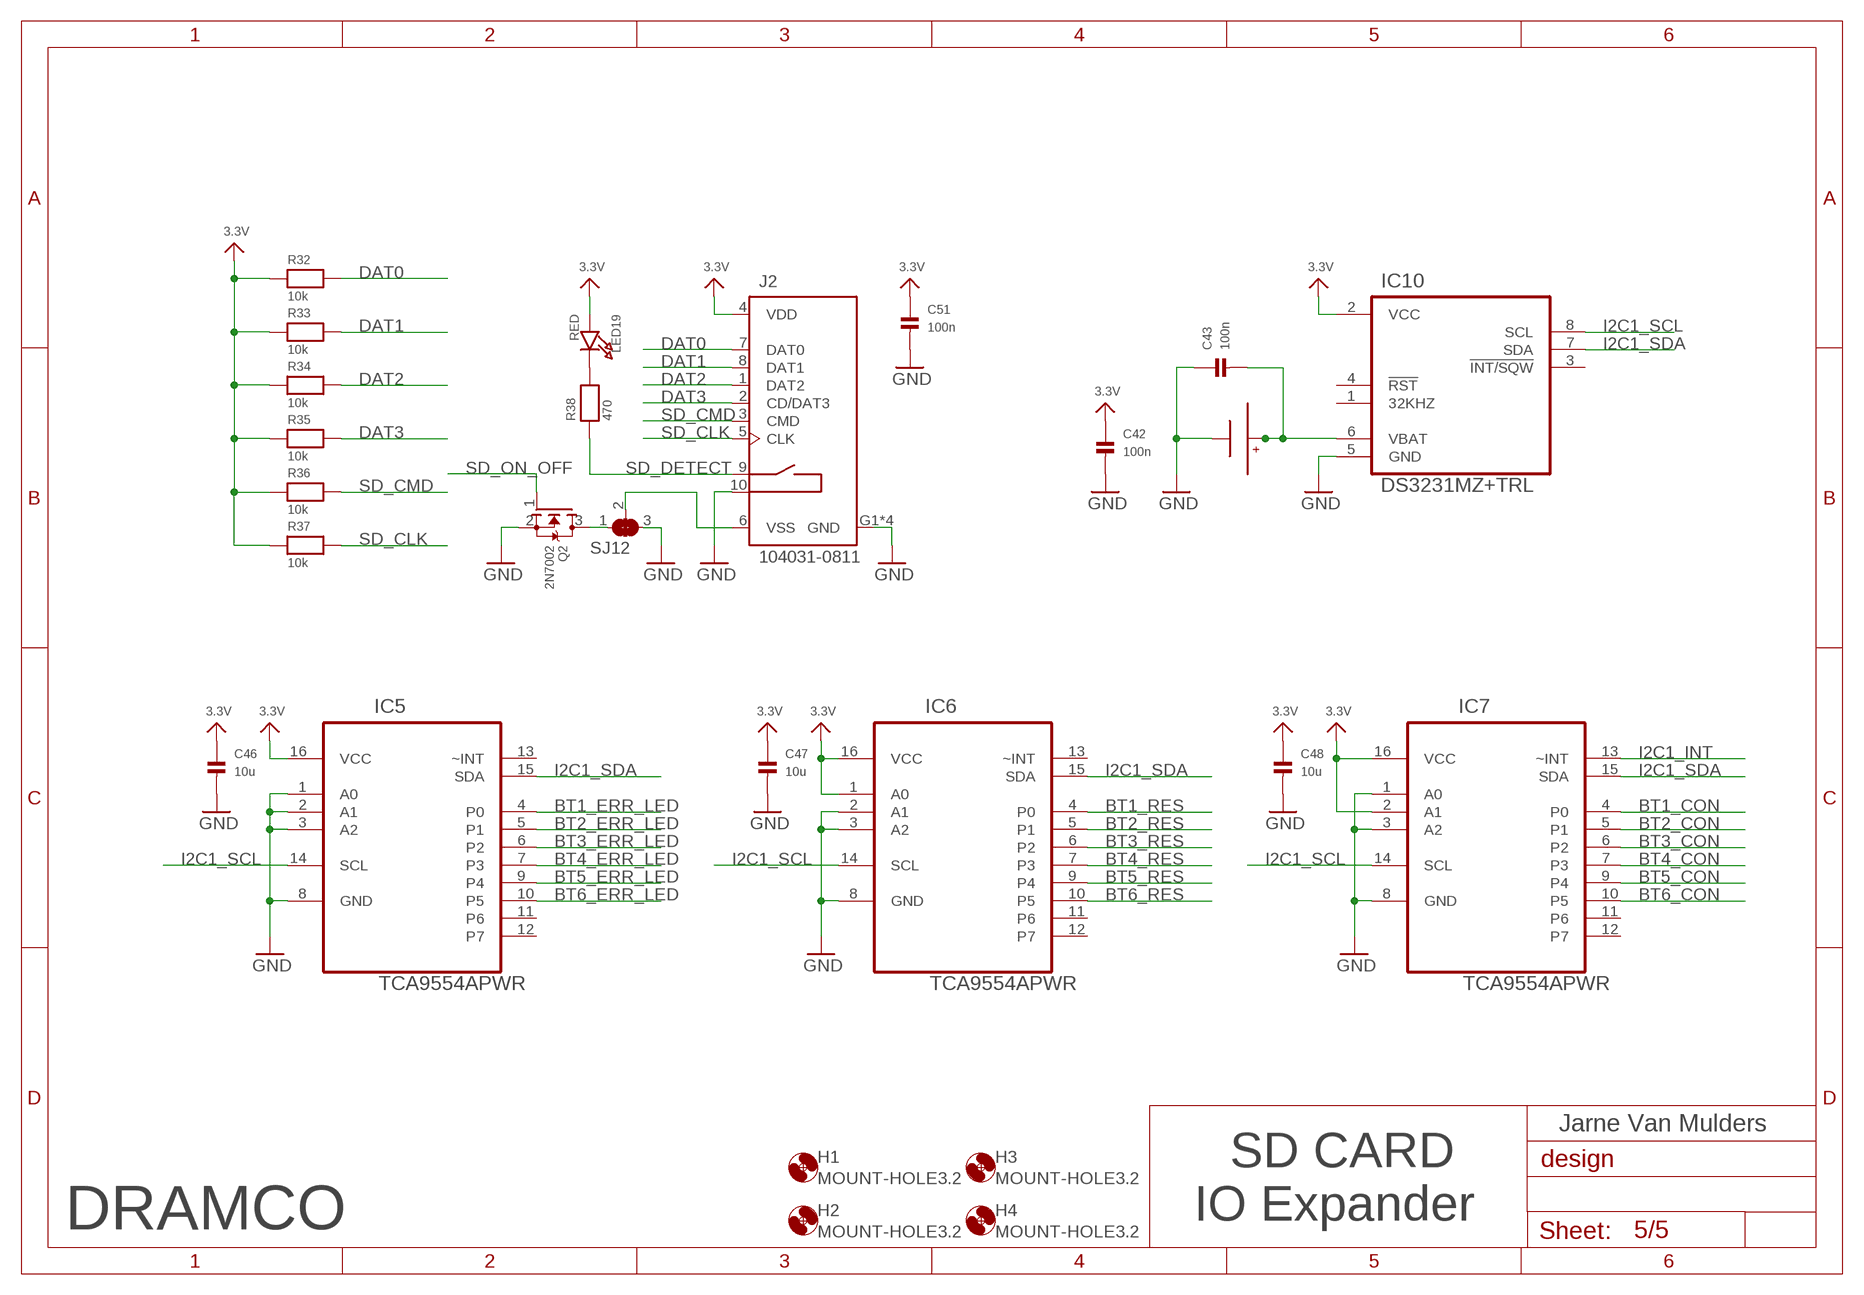
[diagram p4: schematic, sheet 5]

### Parts
C42  100n  CAP_CERAMIC0603  [0603]
C43  100n  CAP_CERAMIC0603  [0603]
C46  10u  CAP_CERAMIC0805  [0805]
C47  10u  CAP_CERAMIC0805  [0805]
C48  10u  CAP_CERAMIC0805  [0805]
C51  100n  CAP_CERAMIC0603  [0603]
H1  MOUNT-HOLE3.2  [3,2]
H2  MOUNT-HOLE3.2  [3,2]
H3  MOUNT-HOLE3.2  [3,2]
H4  MOUNT-HOLE3.2  [3,2]
IC5  TCA9554APWR  [SOP65P640X120-16N]
IC6  TCA9554APWR  [SOP65P640X120-16N]
IC7  TCA9554APWR  [SOP65P640X120-16N]
IC10  DS3231MZ+TRL  [SOIC127P600X175-8N]
J2  104031-0811  [MOLEX_104031-0811]
LED19  RED  LED0805  [CHIPLED_0805]
Q2  2N7002  MOSFET-NWIDE  [SOT23-WIDE]
R32  10k  RESISTOR0603  [0603]
R33  10k  RESISTOR0603  [0603]
R34  10k  RESISTOR0603  [0603]
R35  10k  RESISTOR0603  [0603]
R36  10k  RESISTOR0603  [0603]
R37  10k  RESISTOR0603  [0603]
R38  470  RESISTOR0603  [0603]
SJ12  SOLDERJUMPER_2WAY  [SOLDERJUMPER_2WAY_OPEN_NOPASTE]
U$24  BAT-HLD-001  [BAT-HLD-001]

### Nets
3.3V: C42.1 C46.1 C47.1 C48.1 C51.1 IC5.16(VCC) IC6.1(A0) IC6.16(VCC) IC7.2(A1) IC7.16(VCC) IC10.2(VCC) J2.4(VDD) LED19.A R32.1 R33.1 R34.1 R35.1 R36.1 R37.1 ; also sheet 1,2,3,4
BT1_CON: IC7.4(P0) ; also sheet 3
BT1_ERR_LED: IC5.4(P0) ; also sheet 3
BT1_RES: IC6.4(P0) ; also sheet 3
BT2_CON: IC7.5(P1) ; also sheet 3
BT2_ERR_LED: IC5.5(P1) ; also sheet 3
BT2_RES: IC6.5(P1) ; also sheet 3
BT3_CON: IC7.6(P2) ; also sheet 3
BT3_ERR_LED: IC5.6(P2) ; also sheet 3
BT3_RES: IC6.6(P2) ; also sheet 3
BT4_CON: IC7.7(P3) ; also sheet 3
BT4_ERR_LED: IC5.7(P3) ; also sheet 3
BT4_RES: IC6.7(P3) ; also sheet 3
BT5_CON: IC7.9(P4) ; also sheet 3
BT5_ERR_LED: IC5.9(P4) ; also sheet 3
BT5_RES: IC6.9(P4) ; also sheet 3
BT6_CON: IC7.10(P5) ; also sheet 3
BT6_ERR_LED: IC5.10(P5) ; also sheet 3
BT6_RES: IC6.10(P5) ; also sheet 3
DAT0: J2.7(DAT0) R32.2 ; also sheet 1
DAT1: J2.8(DAT1) R33.2 ; also sheet 1
DAT2: J2.1(DAT2) R34.2 ; also sheet 1
DAT3: J2.2(CD/DAT3) R35.2 ; also sheet 1
GND: C42.2 C43.1 C46.2 C47.2 C48.2 C51.2 IC5.1(A0) IC5.2(A1) IC5.3(A2) IC5.8(GND) IC6.2(A1) IC6.3(A2) IC6.8(GND) IC7.1(A0) IC7.3(A2) IC7.8(GND) IC10.5(GND) J2.10(CARD_DET2) J2.G1(GND) J2.G2(GND) J2.G3(GND) J2.G4(GND) Q2.2(S) SJ12.3 U$24.- ; also sheet 1,2,3,4
I2C1_INT: IC7.13(~INT) ; also sheet 1
I2C1_SCL: IC5.14(SCL) IC6.14(SCL) IC7.14(SCL) IC10.8(SCL) ; also sheet 1
I2C1_SDA: IC5.15(SDA) IC6.15(SDA) IC7.15(SDA) IC10.7(SDA) ; also sheet 1
N$11: J2.6(VSS) SJ12.2
N$12: Q2.3(D) SJ12.1
N$20: LED19.C R38.2
N$48: C43.2 IC10.6(VBAT) U$24.+@1(+) U$24.+@2(+)
SD_CLK: J2.5(CLK) R37.2 ; also sheet 1
SD_CMD: J2.3(CMD) R36.2 ; also sheet 1
SD_DETECT: J2.9(CARD_DET1) R38.1 ; also sheet 1
SD_ON_OFF: Q2.1(G) ; also sheet 1
Unconnected: IC5.11(P6) IC5.12(P7) IC5.13(~INT) IC6.11(P6) IC6.12(P7) IC6.13(~INT) IC7.11(P6) IC7.12(P7) IC10.1(32KHZ) IC10.3(!INT/SQW) IC10.4(!RST)

### Notes on the sheet
- Jarne Van Mulders
- SD CARD
- DRAMCO | IO Expander

## Library data of the parts
BT1-BT6 = WE_WIRL_Rev1:WIRL-BTLE_2608011024010: Proteus-II - Bluetooth Smart 5.0 Module WIRL-BTLE Bluetooth smart 5.0 Standard - PCB Antenna Details see: https://katalog.we-online.com/en/wco/WIRL-BTLE Created By Ella Wu 2019-03-28 2019 (C) Wurth Elektronik; HEIGHT: 2.0mm; MANUFACTURER: Würth Elektronik; NR: 2608011024010
C1-C28 C30 C31 C33-C44 C46-C59 = microbuilder:CAP_CERAMIC: Ceramic Capacitors 0402 - 0402 Surface Mount Capacitors 16pF 50V 5% [Digikey: 445-4899-2-ND] 18pF 50V 5% [Digikey: 490-1281-2-ND] 22pF 50V 5% [Digikey: 490-1283-2-ND] 68pF 50V 5% [Digikey: 490-1289-2-ND] 0.1uF 10V 10% [Digikey: 490-1318-2-ND] 1.0uF 6.3V 10% [Digikey: 490-1320-2-ND] 0603 - 0603 Surface Mount Capacitors 16 pF 50V 5% [Digikey: 445-5051-2-ND] 22 pF 50V [Digikey: PCC220ACVTR-ND] 33 pF 50V 5% [Digikey: 490-1415-1-ND] 56pF 50V 5% [Digikey: 490-1421-1-ND] 220pF 50V 5% [Digikey: 445-1285-1-ND] 680 pF 50V 2200 pF 50V 5% C0G [Digikey: 445-1297-1-ND] 5600 pF 100V 5% X7R [Digikey: 478-3711-1-ND] 0.1 µF 25V 10% [Digikey: PCC2277TR-ND] 0.22 µF 16V 10% X7R [Digikey: 445-1318-1-ND] 1.0 µF 25V 10% [Digikey: 445-5146-2-ND] 0603 - RF Specific 3pF 250V +/-0.1pF RF [Digikey: 712-1347-1-ND] 18 pF 250V 5% [Digikey: 478-3505-1-ND or 712-1322-1-ND] 56 pF 250V 5% C0G RF [Digikey: 490-4867-1-ND] 68 pF 250V RF [Digikey: 490-4868-1-ND] 0805 - 0805 Surface Mount Capacitors 220 pF 250V 2% RF Ceramic Capacitor [Digikey: 712-1398-1-ND] 1000 pF 50V 2% NP0 Ceramic Capacitor [Digikey: 478-3760-1-ND] 0.1 µF 25V 10% Ceramic Capacitor [Digikey: PCC1828TR-ND] 1.0 µF 16V 10% Ceramic Capacitor[Digikey: 490-1691-2-ND] 10.0 µF 10V 10% Ceramic Capacitor[Digikey: 709-1228-1-ND] 10.0 uF 16V 10% Ceramic Capacitor [Digikey: 478-5165-2-ND] 47 uF 6.3V 20% Ceramic Capacitor [Digikey: 587-1779-1-ND or 399-5506-1-ND] 1206 - 1206 Surface Mount Capacitors 47uF 10V 20% Ceramic Capacitor [Digikey: 490-5528-1-ND or 399-5508-1-ND or 445-6010-1-ND] 100uF 6.3V -20%, +80% Y5V Ceramic Capacitor (Digikey: 490-4512-1-ND, Mouser: 81-GRM31CF50J107ZE1L)
C29 C60 = rcl:CPOL-EU: POLARIZED CAPACITOR, European symbol
C32 = Kondensatoren (rev19a):WCAP-ATG8: WCAP-ATG8 Aluminum Electrolytic Capacitors Characteristics Aluminum Electrolytic Capacitor Recommended soldering: Wave Operating temperature: -40 °C to +85 °C for UR ˂ 400 V; -25 °C to +85 °C for UR ≥ 400V Wide capacitance value range Load life: 2000 h @ + 85 °C Package name and Variant abbreviation: Package: D X A X B = Diameter of the outline X Pitch of the hole X Diameter of the hole. Variant: D X L X P X Ø = Diameter of the body part X Height of the body part X Pitch of the pin X Diameter of the pin. <http://katalog.we-online.de/media/images/eisos/WCAP-ATG8_pf2.jpg> Details see: http://katalog.we-online.de/en/pbs/WCAP-ATG8 Created: 2015-02-06 2015 (C) Wurth Elektronik; WE-NUMBER: 860010275016/1000uF
D1 D7 = diode:DIODE-: DIODE
F1 = SparkFun-Fuses:PPTC: Resettable Fuse PPTC Resettable Fuse. Really a sort of resistor with a polymeric positive temperature coefficient whose resistance increases dramatically with an increase in temperature. When heated by the power passing through the resistance rises causing the current to be limited, protecting the circuit. This is achieved by the transition of the polymer from a crystalline to an amorphous state where the conductive carbon separates breaking the conductive pathways found in the cool crystalline structure. When a PPTC cools back down it resumes conducting letting the circuit turn back on. SparkFun Products: SparkFun RedBoard - Programmed with Arduino <https://www.sparkfun.com/products/12757> Pro Micro - 5V/16MHz <https://www.sparkfun.com/products/12640> Arduino Pro 328 - 5V/16MHz <https://www.sparkfun.com/products/10915> MP3 Trigger <https://www.sparkfun.com/products/13720>
H1-H4 = holes:MOUNT-HOLE: MOUNTING HOLE with drill center marker
IC1 = STM32H743ZIT6:STM32H743ZIT6: High-performance and DSP with DP-FPU, ARM Cortex-M7 MCU with 2MBytes Flash, 1MB RAM, 400 MHz CPU, Art Accelerator, L1...; AVAILABILITY: Unavailable; DESCRIPTION: ARM® Cortex®-M7 STM32H7 Microcontroller IC 32-Bit 480MHz 2MB _2M x 8_ FLASH 144-LQFP _20x20_; MF: STMicroelectronics; MP: STM32H743ZIT6; PACKAGE: LQFP-144 STMicroelectronics; PRICE: None
IC2 = FT312D:FT312D
IC3 = SN74LVC2G241DCUT:SN74LVC2G241DCUT: DUAL BUFFER/DRIVER WITH 3-STATE OUTPUTS; AVAILABILITY: Unavailable; DESCRIPTION: Buffer, Non-Inverting 2 Element 1 Bit per Element 3-State Output 8-VSSOP; MF: Texas Instruments; MP: SN74LVC2G241DCUT; PACKAGE: VFSOP-8 Texas Instruments; PRICE: None
IC4 = SparkFun-IC-Comms:CH340G: A simple USB 2.0 to Serial IC.; PROD_ID: IC-13498
IC5-IC7 = TCA9554APWR:TCA9554APWR: 8-BIT I2C AND SMBus I/O EXPANDER; AVAILABILITY: Unavailable; DESCRIPTION: Remote 8-Bit I2C and SMBus I/O Expander 16-TSSOP -40 to 85; MF: Texas Instruments; MP: TCA9554APWR; PACKAGE: TSSOP-16 Texas Instruments; PRICE: None
IC8 = STCC2540:STCC2540: The STCC2540 device integrates, in one package, a USB charger controller, a wide bandwidth data switch, and a high current power switch. The device emulates several profiles compatible with the USB battery charging standard, BC1.2, Chinese telecommunications standard YD/T 1591-2009, and proprietary charger modes. The device asserts the charging flag in DCP modes if the charging current is higher than the threshold. In CDP mode, it asserts the charging flag after the CDP negotiation if the charging current is higher than the threshold. After the current drops below the threshold, the output is deasserted, allowing the host to turn off the high power DC-DC converter and reduce overall consumption in S4/S5 states, which is critical when the host is battery supplied.
IC9 = LM2576HVS-12_NOPB:LM2576HVS-12/NOPB: http://octopart.com/lm2576hvs-5.0%2Fnopb-texas+instruments-1009282; AVAILABILITY: Unavailable; DESCRIPTION: SIMPLE SWITCHE ? 4V to 60V, 3A Low Component Count Step-Down egulator 5-DDPAK/TO-263 -40 to 125; MF: Texas Instruments; MP: LM2576HVS-12; PACKAGE: TO-263-5 Texas Instruments; PRICE: None
IC10 = DS3231MZ_TRL:DS3231MZ+TRL; AVAILABILITY: Unavailable; DESCRIPTION: Real Time Clock _RTC_ IC Clock/Calendar I²C, 2-Wire Serial 8-SOIC _0.154, 3.90mm Width_; MF: Maxim Integrated; MP: DS3231MZ+TRL; PACKAGE: SOIC-8 Maxim; PRICE: None
J1 = InputOutputIO (rev19b):614004190021: USB TYPE A UP RIGHT THT - SHORT TYPE =>ConUSB2 614004190021 Characteristics INSULATOR:PBT FLAMMABILITY RATING: UL94-V0 COLOR: WHITE CONTACT PLATING: GOLD OVER Ni COVER MATERIAL: BRASS COVER PLATING: Ni QUALITY CLASS: 15000 MATING CYCLES OPERATING TEMPERATURE:-40°C UP TO +85°C COMPLIANCE: LEAD FREE AND ROHS ELECTRICAL CURRENT RATING: - PIN 1 & PIN 4: 3A - OTHER PINS: 0,5A WORKING VOLTAGE: 30 VAC MAX WITHSTANDING VOLTAGE: 500 VAC/MIN INSULATION RESISTANCE: > 1000 MΩ CONTACT RESISTANCE: 30 mΩ MAX <http://katalog.we-online.de/media/images/v2/Family_WR-COM_614004190021_4C.jpg> Details see: http://katalog.we-online.de/en/em/COM_2_0_THT_TYPE_A_HORIZONTAL/614004190021? 2015 (C) Wurth Elektronik
J2 = 104031-0811:104031-0811: 1.10mm Pitch microSD Memory Card Connector, SMT, Push-Pull Type, 1.42mm Height, with Detect Switch; AVAILABILITY: Unavailable; DESCRIPTION: 10 _8 + 2_ Position Card Connector Secure Digital - microSD™ Surface Mount, Right Angle Gold; MF: Molex; MP: 104031-0811; PACKAGE: None; PRICE: None
J3 = microbuilder:HEADER-1X6: PIN HEADER
JP3 = daspilker:USB-RECEPTABLE: USB Receptable
K1 = Wurth_Elektronik_Electromechanic_DC_Power_Jack_Connectors_rev15c:694106301002: WR-DC_DC Power Jack_Right Angled_THT Center Pin Ø2.0_Plug ID Ø2.05_Plug OD Ø5.5 ;=>Code : Con_WR-DC_THT_694108301002_694106301002 <http://katalog.we-online.de/media/images/eican/Con_WR-DC_THT_694108301002_pf2.jpg> Details see: http://katalog.we-online.de/em/datasheet/6941xx301002.pdf Created 2014-10-08, Karrer Zheng 2014 (C) Wurth Elektronik
L1 = PowerMagnetics (rev18e):WE-PD_1210: SMD Shielded Power Inductor Characteristics Magnetically shielded version which results in a low leakage field High Saturation currents up to 25 A Very low self-losses at high switching frequency‘s Wide inductances spectrum available at all sizes Operating temperature: –40 °C to +125 °C Applications Perfectly suitable for switching regulators with extremely high efficiency Integrated DC/DC- converter Switching regulators with low operating voltages (Graphic cards, embedded PC-Cards, Mainboards) Plastic base: Because of the one piece construction these are more suitable for high vibration or shock applications <http://katalog.we-online.de/media/images/v2/Family_WE-PD.jpg> Details see: http://katalog.we-online.de/en/pbs/WE-PD? Updated by Dan Xu 2014-07-08 2014 (C) Wurth Elektronik; WE-NUMBER: 7447709820/82uH
L3 = microbuilder:INDUCTOR: Inductors 0603: 10nH Ceramic Inductor - microwire antenna/RF (Digikey: 712-1434-2-ND) 0805: 560nH Ceramic Inductor - RF (Digikey: 553-1047-1-ND) 270nH Ceramic Inductor - Q = 40@250MHz, +-5%, 1 Ohm DC Resistance (Digikey: 535-10506-2-ND) 1007 (2518 Metric) SMT: 10µH 10% 250mOhm 820mA 1007 Inductor (Digikey: 587-2189-1-ND) 22µH 10% 500mOhm 580mA 1007 Inductor (Digikey: 587-2190-1-ND) 47µH 10% 950mOhm 420mA 1007 Inductor (Digikey: 587-2191-1-ND) 47µH 5% 100mOhm 1A 1008 Inductor (Digikey: 732-1816-1-ND) 5.0x5.0mm (Taiyo Yuden NR5040 Series) 6.8µH 20% 2.3A 64mOhm Inductor (Digikey: 587-2374-2-ND) 5.0x5.0mm (TDK VLC5045 Series) 4.7µH 20% 3.3A 34mOhm Inductor (Digikey: 445-6526-1-ND) 6.8µH 20% 2.7A 46mOhm Inductor (Digikey: 445-6527-1-ND) 6.0x6.0mm (TDK VLC6045 Series) 4.7µH 20% 3.8A 27mOhm Inductor (Digikey: 445-6538-2-ND) 6.8µH 20% 3A 41mOhm Inductor (Digikey: 445-6540-1-ND) 6.2µH 30% 2.2A 45mOhm Inductor (Digikey: SRR5028-6R2YCT-ND) - Not TDK VLC6045 but footprint should match 6.0x6.0mm (TDK SLF6045 Series) 6.8uH 30% 2A 33mOhm Inductor (Digikey: 445-4572-1-ND, Mouser: 810-SLF645T6R8N2R0PF)
LED1-LED21 = microbuilder:LED: LED 0603 - 0603 Surface Mount Package 2mA: Green LED - Low Power (3.9mcd, 2ma, 1.7Vf) - Digikey: 475-2709-2-ND Orange LED - Low Power (9.8mcd, 2ma, 1.8Vf) - Digikey: 475-1194-2-ND Red LED - Low Power (5mcd, 2ma, 1.8Vf) - Digikey: 475-1195-2-ND Yellow LED - Low Power (7mcd, 2ma, 1.8Vf) - Digikey: 475-1196-2-ND 5mA: Blue LED - Low Power (17mcd, 5ma, 2.9Vf) - Digikey: LNJ937W8CRACT-ND 0805 - 0805 Surface Mount Package 2mA: Red LED (8.8mcd, 2mA, 1.8Vf, Clear) - Low Power [Digikey: 475-2510-1-ND] Green LED (5mcd, 2mA, 1.8Vf, Clear) - Low Power [Digikey: 475-2730-1-ND] Yellow LED (11.3mcd, 2mA, 1.8Vf, Clear) - Low Power [Digikey: 475-2555-1-ND] 20mA: Red LED (104mcd, 20mA, Diffused) - LS R976 [Digikey: 475-1278-6-ND] Red LED (12mcd, 20mA, 2.0Vf, Clear) - APT2012EC [Digikey: 754-1128-1-ND] Green LED (15mcd, 20mA, 2.2Vf, Clear) - APT2012GC [Digikey: 754-1131-1-ND] Orange LED (160mcd, 20mA, 2.1Vf, Clear) - APT2012SECK [Digikey: 754-1130-1-ND] 1206 - 1206 Surface Mount Package Green LED (26mcd, 20mA, Diffused) - LG N971 [Digikey: 475-1407-6-ND] Red LED (15mcd, 20mA, Diffused) - LH N974 [Digikey: 475-1416-6-ND]
Q1 Q2 = microbuilder:MOSFET-N: N-Channel Mosfet LEGEND VDS: Voltage Drain-Source ID: Drain Current RDS(ON): Drain-Source On-State Resistance VGS(TH): Gate-Source Threshold Voltage CISS: Drain-Source Input Capacitance SOT-23 Name VDS ID RDS(ON) VGS(TH) CISS Order Number 2N7002E 60V 260mA 2.5 Ohm 2.5V @ 250uA 26.7pF @ 25V 2N7002ET1GOSTR-ND BSH103 30V 850mA 400 mOhm 400mV @ 1mA 83pF @ 24V BSH103,235-ND BSS138 60V 320mA 1.6 Ohm 1.5V @ 250uA 50pF @ 10V Mouser: 771-BSS138PW115 DMN2075U-7 20V 4.2A 38 mOhm 1V @ 250 uA 594.3pF @ 10V DMN2075U-7DICT-ND * BSS138 good choice for I2C level-shifting
R1-R25 R29-R44 R46 R47 = microbuilder:RESISTOR: Resistors 0402 - 0402 Surface Mount Package 22 Ohm 1% 1/16W [Digikey: 311-22.0LRTR-ND] 33 Ohm 5% 1/16W 1.0K 5% 1/16W 1.5K 5% 1/16W 2.0K 1% 1/16W 10.0K 1% 1/16W [Digikey: 311-10.0KLRTR-ND] 10.0K 5% 1/16W [Digikey: RMCF0402JT10K0TR-ND] 12.1K 1% 1/16W [Digikey: 311-22.0LRTR-ND] 100.0K 5% 1/16W 0603 - 0603 Surface Mount Package 0 Ohm 1/10 Watt 1% Resistor 15 Ohm 1/10 Watt 1% Resistor 33 Ohm 1/10 Watt 1% Resistor 49.9 Ohm 1/10 Watt 1% Resistor 100 Ohm 1/10 Watt 1% Resistor 150 Ohm 1/10 Watt 1% Resistor 240 Ohm 1/10 Watt 1% Resistor 390 Ohm 1/10 Watt 1% Resistor 560 Ohm 1/10 Watt 1% Resistor 680 Ohm 1/10 Watt 1% Resistor 750 Ohm 1/10 Watt 1% Resistor 1.0K Ohm 1/10 Watt 1% Resistor 1.5K Ohm 1/10 Watt 1% Resistor 2.0K Ohm 1/10 Watt 1% Resistor 2.2K Ohm 1/10 Watt 1% Resistor 3.3K Ohm 1/10 Watt 1% Resistor 4.7K Ohm 1/10 Watt 1% Resistor 10.0K Ohm 1/10 Watt 1% Resistor 12.0K Ohm 1/10 Watt 1% Resistor 12.1K Ohm 1/10 Watt 1% Resistor 20.0K Ohm 1/10 Watt 1% Resistor 33.0K Ohm 1/10 Watt 1% Resistor 100.0K Ohm 1/10 Watt 1% Resistor 0805 - 0805 Surface Mount Package 0 Ohm 1/8 Watt 1% Resistor 33 Ohm 1/8 Watt 1% Resistor 100 Ohm 1/8 Watt 1% Resistor 150 Ohm 1/8 Watt 1% Resistor 200 Ohm 1/8 Watt 1% Resistor 240 Ohm 1/8 Watt 1% Resistor 330 Ohm 1/8 Watt 1% Resistor 390 Ohm 1/8 Watt 1% Resistor 470 Ohm 1/8 Watt 1% Resistor 1.0K Ohm 1/8 Watt 1% Resistor 1.5K Ohm 1/8 Watt 1% Resistor 2.0K Ohm 1/8 Watt 1% Resistor 4.7K Ohm 1/8 Watt 1% Resistor 5.1K Ohm 1/8 Watt 1% Resistor 5.6K Ohm 1/8 Watt 1% Resistor 10.0K Ohm 1/8 Watt 1% Resistor 22.0K Ohm 1/8 Watt 1% Resistor 33.0K Ohm 1/8 Watt 1% Resistor 100K Ohm 1/8 Watt 1% Resistor 1206 - 1206 Surface Mount Package 2012 - 2010 Surface Mount Package 0.11 Ohm 1/2 Watt 1% Resistor - Digikey: RHM.11UCT-ND
RESET USER = Eagle_SWITCHES (rev18c):434111043826: 6.0x3.5 mm SMD WS-TASV <http://katalog.we-online.de/media/images/v2/Family_WS-TASV_6.0x3.jpg> Details see: http://katalog.we-online.de/em/datasheet/4341x1xxx8x6.pdf 2015 (C) Wurth Elektronik
SJ1-SJ5 SJ8-SJ11 = microbuilder:SOLDERJUMPER: SMD Solder JUMPER Solder the two pads together to create a connection, or remove the solder to break it. REFLOW - Use this footprint for solder paste and reflow ovens. WAVE - Use this footprint for hand-soldering (larger pads). CLOSED - Has a trace between the two pads to ensure it is closed by default. The trace needs to be cut to disable the jumper, and can be closed again by creating a solder bridge between the two pads.
SJ12 = microbuilder:SOLDERJUMPER_2WAY: 2-Way Solder Jumper
SJ13 = microbuilder:SOLDERJUMPER_CLOSED: Solder Jumper - Closed These solder jumpers are closed by default CLOSEDWIRE - 10 mil trace between pads that can be cut and resoldered later CLOSEDPERM - 63 mil trace between pads for a permanent connection (used to 'bridge' two signals, a shameless hack for Eagle). Can double as a test point as well (no cream layer)
U1 = microbuilder:LM1117: LM1117 Voltage Regulator LM1117 Adjustable Voltage regulator [Digikey: LM1117IMP-ADJDKR-ND] LM1117 3.3V Voltage regulator [AP1117E33GDIDKR-ND] LM1117 5.0V Voltage regulator [AP1117E50GDIDKR-ND] SOT223-REFLOW - SOT223 package for solder paste/reflow ovens SOT223-WAVE - SOT223 package for hand-soldering (larger pads) Note: For the fixed-voltage regulators, simply set the ADJ pin to GND.
U$24 = BAT-HLD-001:BAT-HLD-001: Linx Technologies BAT-HLD-001 surface mount CR2032 single-cell holder digikey: BAT-HLD-001-ND; AVAILABILITY: Unavailable; DESCRIPTION: Battery Retainer Coin, 20.0mm 1 Cell SMD _SMT_ Tab; MF: Linx Technologies; MP: BAT-HLD-001; PACKAGE: None; PRICE: None
XTAL XTAL1-XTAL3 = SparkFun-Clocks:CRYSTAL: Crystals (Generic) These are passive quartz crystals, which can be used as a clock source for a microcontroller. Crystal's are two-terminal devices. They require external "load" capacitors to generate an oscillating signal.